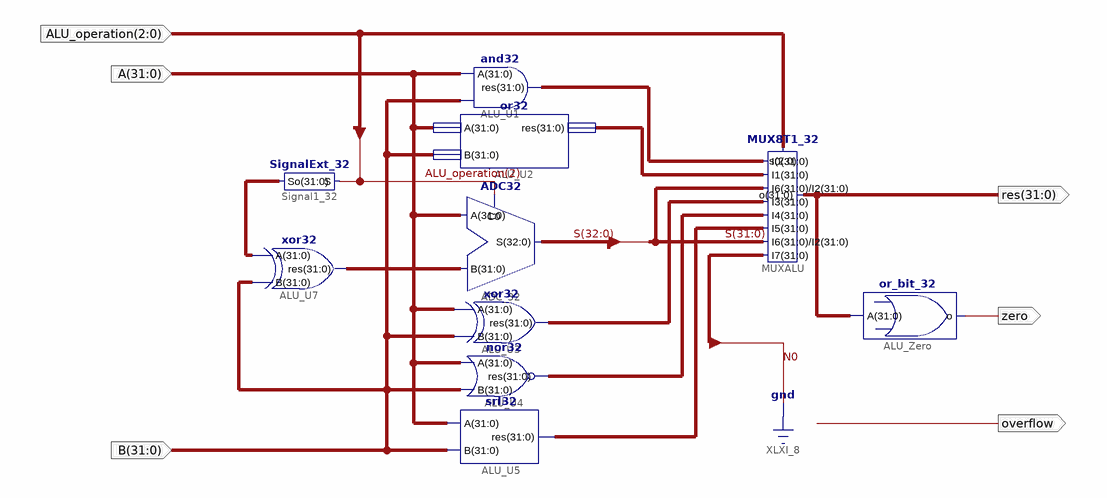
[diagram p0: schematic sheet 1]
// Xilinx ISE schematic ALU.sch (kintex7) as structural Verilog: 10 symbols, 6 ports
module ALU (
  input  [31:0] A,
  input  [31:0] B,
  input  [2:0] ALU_operation,
  output [31:0] res,
  output zero,
  output overflow
);

  wire [31:0] XLXN_1, XLXN_13, XLXN_15, XLXN_21, XLXN_23, XLXN_27, XLXN_31;
  wire [32:0] S;

  ADC32 ADC_32 (.B(XLXN_23), .A(A), .C0(ALU_operation[2]), .S(S));
  xor32 ALU_U3 (.A(A), .B(B), .res(XLXN_27));
  nor32 ALU_U4 (.res(XLXN_13), .A(A), .B(B));
  and32 ALU_U1 (.res(XLXN_1), .A(A), .B(B));
  MUX8T1_32 MUXALU (
    .s(ALU_operation), .I7({{31{1'b0}}, S[32]}), .I6(S[31:0]), .I5(XLXN_15), .I4(XLXN_13), .I3(XLXN_27),
    .I2(S[31:0]), .I1(XLXN_31), .I0(XLXN_1), .o(res));
  srl32 ALU_U5 (.A(A), .B(B), .res(XLXN_15));
  SignalExt_32 Signal1_32 (.So(XLXN_21), .S(ALU_operation[2]));
  xor32 ALU_U7 (.A(XLXN_21), .B(B), .res(XLXN_23));
  or_bit_32 ALU_Zero (.o(zero), .A(res));
  or32 ALU_U2 (.A(A), .B(B), .res(XLXN_31));
endmodule
